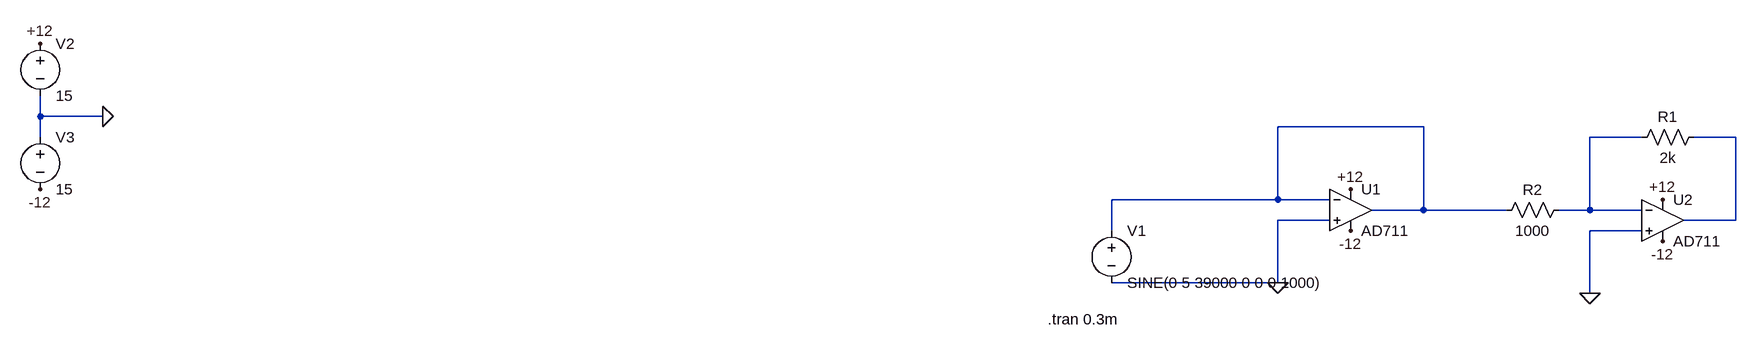
[diagram p0: schematic Montage 3 et 4.asc]
Montage 3 et 4.asc, the LTspice schematic file:
Version 4
SHEET 1 948 680
WIRE -1664 96 -1664 64
WIRE -1568 96 -1664 96
WIRE 464 112 240 112
WIRE -1664 128 -1664 96
WIRE 800 128 720 128
WIRE 944 128 880 128
WIRE 240 224 240 112
WIRE 240 224 -16 224
WIRE 320 224 240 224
WIRE 464 240 464 112
WIRE 464 240 384 240
WIRE 592 240 464 240
WIRE 720 240 720 128
WIRE 720 240 672 240
WIRE 800 240 720 240
WIRE 320 256 240 256
WIRE 944 256 944 128
WIRE 944 256 864 256
WIRE -16 272 -16 224
WIRE 800 272 720 272
WIRE 240 352 240 256
WIRE 240 352 -16 352
WIRE 720 368 720 272
FLAG 240 352 0
FLAG 352 208 +12
FLAG 352 272 -12
FLAG -1664 -16 +12
FLAG -1664 208 -12
FLAG -1568 96 0
FLAG 720 368 0
FLAG 832 224 +12
FLAG 832 288 -12
SYMBOL OpAmps\\AD711 352 176 R0
SYMATTR InstName U1
SYMBOL voltage -1664 112 R0
WINDOW 123 0 0 Left 0
WINDOW 39 0 0 Left 0
SYMATTR InstName V3
SYMATTR Value 15
SYMBOL voltage -1664 -32 R0
WINDOW 123 0 0 Left 0
WINDOW 39 0 0 Left 0
SYMATTR InstName V2
SYMATTR Value 15
SYMBOL voltage -16 256 R0
WINDOW 123 0 0 Left 0
WINDOW 39 0 0 Left 0
SYMATTR InstName V1
SYMATTR Value SINE(0 5 39000 0 0 0 1000)
SYMBOL OpAmps\\AD711 832 192 R0
SYMATTR InstName U2
SYMBOL res 896 112 R90
WINDOW 0 0 56 VBottom 2
WINDOW 3 32 56 VTop 2
SYMATTR InstName R1
SYMATTR Value 2k
SYMBOL res 688 224 R90
WINDOW 0 0 56 VBottom 2
WINDOW 3 32 56 VTop 2
SYMATTR InstName R2
SYMATTR Value 1000
TEXT -114 408 Left 2 !.tran 0.3m

The netlist it stands for:
* Montage 3 et 4.asc
XU1 0 N001 +12 -12 N001 AD712  ; AD711, pins In+ In- V+ V- OUT
V3 0 -12 15
V2 +12 0 15
V1 N001 0 SINE(0 5 39000 0 0 0 1000)
XU2 0 N002 +12 -12 N003 AD712  ; AD711, pins In+ In- V+ V- OUT
R1 N003 N002 2k
R2 N002 N001 1000
.tran 0.3m
.lib ADI1.lib
.backanno
.end